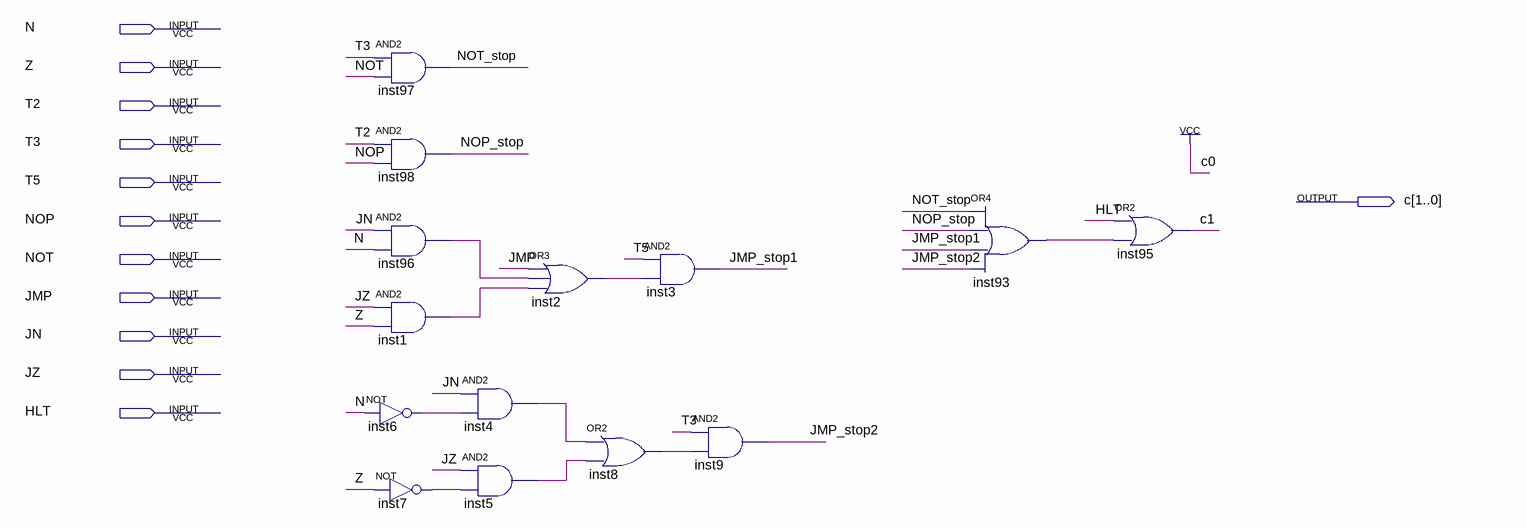
[diagram p0: schematic sheet]
// Quartus schematic jpd_counter_control_logic.bdf as structural Verilog: 14 symbols, 12 pins
module jpd_counter_control_logic (
  input  N,
  input  Z,
  input  T2,
  input  T3,
  input  T5,
  input  NOP,
  input  NOT,
  input  JMP,
  input  JN,
  input  JZ,
  input  HLT,
  output [1:0] c
);

  wire inst1_out, inst2_out, inst4_out, inst5_out, inst6_out, inst7_out, inst8_out, inst93_out, inst96_out,
       JMP_stop1, JMP_stop2, NOP_stop, NOT_stop;

  and inst97 (NOT_stop, T3, NOT);
  and inst98 (NOP_stop, T2, NOP);
  and inst96 (inst96_out, JN, N);
  and inst1 (inst1_out, JZ, Z);
  not inst6 (inst6_out, N);
  not inst7 (inst7_out, Z);
  or inst2 (inst2_out, JMP, inst96_out, inst1_out);
  and inst4 (inst4_out, JN, inst6_out);
  and inst5 (inst5_out, JZ, inst7_out);
  or inst8 (inst8_out, inst4_out, inst5_out);
  and inst3 (JMP_stop1, T5, inst2_out);
  and inst9 (JMP_stop2, T3, inst8_out);
  or inst93 (inst93_out, NOT_stop, NOP_stop, JMP_stop1, JMP_stop2);
  or inst95 (c[1], HLT, inst93_out);

  assign c[0] = 1'b1;
endmodule
